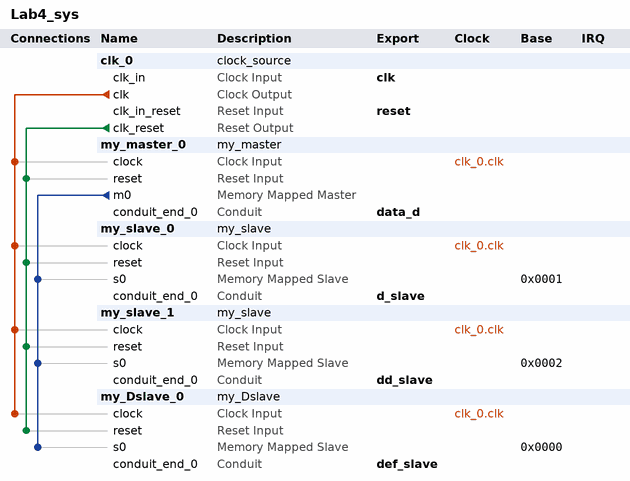
[diagram p0: system contents]
# Platform Designer (Qsys) system Lab4_sys, Cyclone IV E EP4CE6E22C8
# Parameters at their usual value, and those the tool derives, are not listed.
package require -exact qsys 16.1
create_system Lab4_sys
set_project_property DEVICE_FAMILY {Cyclone IV E}
set_project_property DEVICE EP4CE6E22C8

add_instance clk_0 clock_source 16.1
set_instance_parameter_value clk_0 clockFrequency 50000000
set_instance_parameter_value clk_0 resetSynchronousEdges DEASSERT

add_instance my_master_0 my_master 1.0

add_instance my_slave_0 my_slave 1.0

add_instance my_slave_1 my_slave 1.0

add_instance my_Dslave_0 my_Dslave 1.0

# connections
add_connection clk_0.clk my_Dslave_0.clock clock
add_connection clk_0.clk my_master_0.clock clock
add_connection clk_0.clk my_slave_0.clock clock
add_connection clk_0.clk my_slave_1.clock clock
add_connection clk_0.clk_reset my_Dslave_0.reset reset
add_connection clk_0.clk_reset my_master_0.reset reset
add_connection clk_0.clk_reset my_slave_0.reset reset
add_connection clk_0.clk_reset my_slave_1.reset reset
add_connection my_master_0.m0 my_Dslave_0.s0 avalon
set_connection_parameter_value my_master_0.m0/my_Dslave_0.s0 baseAddress 0x0000
set_connection_parameter_value my_master_0.m0/my_Dslave_0.s0 defaultConnection true
add_connection my_master_0.m0 my_slave_0.s0 avalon
set_connection_parameter_value my_master_0.m0/my_slave_0.s0 baseAddress 0x0001
add_connection my_master_0.m0 my_slave_1.s0 avalon
set_connection_parameter_value my_master_0.m0/my_slave_1.s0 baseAddress 0x0002

# exported interfaces
add_interface clk clock sink
set_interface_property clk EXPORT_OF clk_0.clk_in
add_interface d_slave conduit end
set_interface_property d_slave EXPORT_OF my_slave_0.conduit_end_0
add_interface data_d conduit end
set_interface_property data_d EXPORT_OF my_master_0.conduit_end_0
add_interface dd_slave conduit end
set_interface_property dd_slave EXPORT_OF my_slave_1.conduit_end_0
add_interface def_slave conduit end
set_interface_property def_slave EXPORT_OF my_Dslave_0.conduit_end_0
add_interface reset reset sink
set_interface_property reset EXPORT_OF clk_0.clk_in_reset

set_interconnect_requirement {$system} qsys_mm.clockCrossingAdapter HANDSHAKE
set_interconnect_requirement {$system} qsys_mm.enableEccProtection FALSE
set_interconnect_requirement {$system} qsys_mm.insertDefaultSlave FALSE
set_interconnect_requirement {$system} qsys_mm.maxAdditionalLatency 1

save_system Lab4_sys.qsys
